# Altium schematic sheet Sawtooth Generator.SchDoc
size B; SheetNumber: 4; SheetTotal: 7
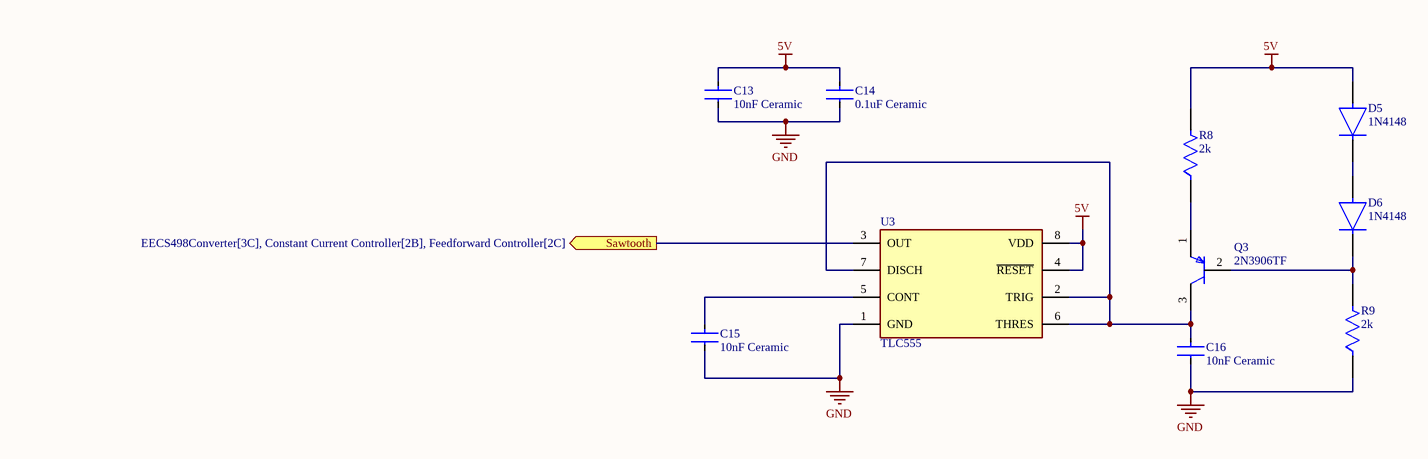
[diagram p0: Sawtooth Generator.SchDoc]

## Parts
C13  10nF Ceramic  [FP-K15H5-MFG]
C14  0.1uF Ceramic  [FP-K15H5-MFG]
C15  10nF Ceramic  [FP-K15H5-MFG]
C16  10nF Ceramic  [FP-K15H5-MFG]
D5  1N4148  [FP-1N4148-MFG]
D6  1N4148  [FP-1N4148-MFG]
Q3  2N3906TF  [2N3906TF]
R8  2k  [FP-RLR07-MFG]
R9  2k  [FP-RLR07-MFG]
U3  TLC555  [DIP8]

## Ports
Sawtooth (out, see EECS498Converter[3C], Constant Current Controller[2B], Feedforward Controller[2C])

## Nets
5V: C13.1 C14.1 D5.2(A) R8.2 U3.4(~{RESET}) U3.8(VDD)
GND: C13.2 C14.2 C15.2 C16.2 R9.1 U3.1(GND)
Sawtooth: U3.3(OUT) ; port Sawtooth
NetC15_1: C15.1 U3.5(CONT)
NetC16_1: C16.1 Q3.3(C) U3.2(TRIG) U3.6(THRES) U3.7(DISCH)
NetD5_1: D5.1(C) D6.2(A)
NetD6_1: D6.1(C) Q3.2(B) R9.2
NetQ3_1: Q3.1(E) R8.1

## Library data of the parts
C13 C15 C16 = 10nF Capacitor: CAP CER 10nF 50V X7R RADIAL; Capacitance: 100nF; Tolerance: 10%; Lead Length: 30mm; Lead Diameter: 0.5mm; Lead/Base Style: Formed Leads; Diameter: 500um; Max Operating Temperature: 125°C; Dielectric Material: Ceramic; Case/Package: Dipped; Dielectric: X7R; Lead Free: Lead Free; Construction: RADIAL; Voltage: 50V; Thickness: 2.6mm; Min Operating Temperature: -55°C; Lead Pitch: 5mm; Height: 4mm; Radiation Hardening: No; Voltage Rating: 50V; Depth: 2.5mm; Voltage Rating (DC): 50V; Package Quantity: 1; Weight: 0.005644oz; Series: K; Mount: Through Hole; Termination: Radial; Height - Seated (Max): 0.257inch; Length: 4mm; Packaging: Tape and Reel; Width: 2.5mm; RoHS Compliant: Yes
C14 = 0.1uF Capacitor: CAP CER 0.1UF 50V X7R RADIAL; Capacitance: 100nF; Tolerance: 10%; Lead Length: 30mm; Lead Diameter: 0.5mm; Lead/Base Style: Formed Leads; Diameter: 500um; Max Operating Temperature: 125°C; Dielectric Material: Ceramic; Case/Package: Dipped; Dielectric: X7R; Lead Free: Lead Free; Construction: RADIAL; Voltage: 50V; Thickness: 2.6mm; Min Operating Temperature: -55°C; Lead Pitch: 5mm; Height: 4mm; Radiation Hardening: No; Voltage Rating: 50V; Depth: 2.5mm; Voltage Rating (DC): 50V; Package Quantity: 1; Weight: 0.005644oz; Series: K; Mount: Through Hole; Termination: Radial; Height - Seated (Max): 0.257inch; Length: 4mm; Packaging: Tape and Reel; Width: 2.5mm; RoHS Compliant: Yes
D5 D6 = 1N4148: DIODE GEN PURP 100V 200MA DO35; Forward Voltage: 1V; Max Power Dissipation: 500mW; Max Reverse Current: 5uA; Forward Current: 300mA; Current: 4A; Reverse Recovery Time: 4ns; Element Configuration: Single; Outside Diameter: 1.85mm; Capacitance: 4pF; Polarity: Standard; Max Forward Surge Current (Ifsm): 1A; Reverse Voltage: 100V; Output Current: 200mA; Average Rectified Current: 200mA; Diameter: 1.91mm; Max Repetitive Reverse Voltage (Vrrm): 100V; Current Rating: 200mA; Case/Package: DO-35; Lead Free: Lead Free; Number of Pins: 2; Recovery Time: 4ns; Packaging: Bulk; Contact Plating: Tin; Voltage: 100V; Mount: Through Hole; Max Surge Current: 4A; Package Quantity: 2000; Width: 1.91mm; Max Reverse Voltage (DC): 100V; Length: 4.56mm; Radiation Hardening: No; Power Dissipation: 500mW; Voltage Rating (DC): 100V; Peak Non-Repetitive Surge Current: 4A; REACH SVHC: No SVHC; Height: 4.56mm; Max Operating Temperature: 175°C; Series: -; Weight: 0.01lb; Min Operating Temperature: -65°C
Q3 = 2N3906TF: 2N3906TF Small Signal Bipolar Transistor, 0.2A I(C), 40V V(BR)CEO, 1-Element, PNP, Silicon, TO-92; NexarPartId: 84408866; Manufacturer Lifecycle Status: ACTIVE; Collector Base Voltage (VCBO): -40V; Frequency: 250MHz; Number of Elements: 1; Max Power Dissipation: 625mW; Max Breakdown Voltage: 160V; Current Rating: -200mA; Emitter Base Voltage (VEBO): -5V; Collector Emitter Saturation Voltage: -400mV; Element Configuration: Single; Max Junction Temperature (Tj): 150°C; hFE Min: 100; Polarity: PNP; Lead Free: Lead Free; RoHS: Compliant; Max Operating Temperature: 150°C; Collector Emitter Voltage (VCEO): -40V; Max Frequency: 250MHz; Power Dissipation: 625mW; Height: 5.33mm; Schedule B: 8541210080; Mount: Through Hole; Length: 5.2mm; REACH SVHC: No SVHC; Min Operating Temperature: -55°C; Gain Bandwidth Product: 250MHz; Number of Pins: 3; Lifecycle Status: Production; Transition Frequency: 250MHz; Collector Emitter Breakdown Voltage: -40V; Case/Package: TO-92; Packaging: Tape and Reel; Width: 4.19mm; Max Collector Current: -200mA; Radiation Hardening: No; Weight: 240mg; Voltage Rating (DC): -40V
R8 R9 = Resistor: Resistor, ± 1%, 250 mW, Axial Leaded, Metal Film, Military Reliability; NexarPartId: 39453770; Max Power Dissipation: 250mW; Resistance: 100kΩ; Lead Length: 38.1mm; Voltage Rating: 250V; Lead Diameter: 640µm; Temperature Coefficient: 100ppm/°C; Wire/Cable Diameter: 50.8µm; Military Standard: MIL-PRF-39017; REACH SVHC: Unknown; Min Operating Temperature: -65°C; Length: 7.62mm; Case/Package: Axial; Lead Free: Contains Lead; Height: 2.5mm; Contact Plating: Lead, Tin; Radiation Hardening: No; Composition: Metal Film; Voltage Rating (DC): 250V; Schedule B: 8533210090, 8533210090|8533210090, 8533210090|8533210090|8533210090, 8533210090|8533210090|8533210090|8533210090; Diameter: 2.29mm; Tolerance: 1%; Max Operating Temperature: 150°C; Number of Terminations: 2; RoHS: Non-Compliant; Features: Military, Moisture Resistant, Weldable; Power Rating: 250mW; Packaging: Bulk; Width: 2.29mm; Termination: Axial; Failure Rate: 0.001%
U3 = TLC555: IC OSC SGL TIMER 2.1MHZ 8-SOIC; Min Supply Voltage: 2V; Number of Channels: 1; Max Power Dissipation: 725mW; Max Supply Voltage: 15V; Low Level Output Current: 100mA; Current Rating: 250A; Quiescent Current: 250uA; Operating Supply Current: 360uA; High Level Output Current: -10mA; Width: 3.91mm; Case/Package: SOIC; Weight: 0.002561oz; Frequency: 2.1MHz; Height: 1.58mm; Package Quantity: 2500; REACH SVHC: No SVHC; Number of Timers/Counters: 1; Lead Free: Lead Free; Number of Pins: 8; Max Operating Temperature: 125°C; Min Operating Temperature: -40°C; Length: 4.9mm; Radiation Hardening: No; Packaging: Tape and Reel; Termination: SMD/SMT; Mount: Surface Mount; Power Dissipation: 725mW